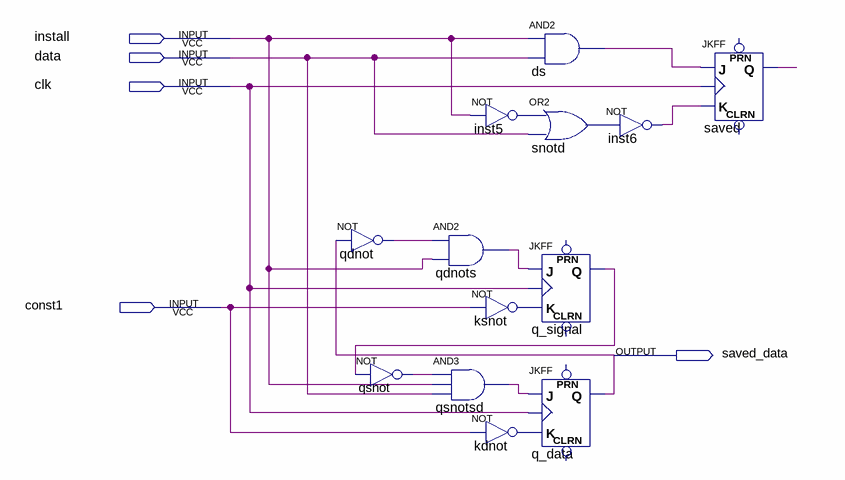
[diagram p0: schematic sheet]
// Quartus schematic onebitsaver.bdf as structural Verilog: 13 symbols, 5 pins
module onebitsaver (
  input  install,
  input  data,
  input  clk,
  input  const1,
  output saved_data
);

  wire ds_out, inst5_out, inst6_out, kdnot_out, ksnot_out, q_signal_q, qdnot_out, qdnots_out, qsnot_out,
       qsnotsd_out, saved_q, snotd_out;

  not qdnot (qdnot_out, saved_data);
  not qsnot (qsnot_out, q_signal_q);
  and qdnots (qdnots_out, qdnot_out, install);
  and qsnotsd (qsnotsd_out, qsnot_out, install, data);
  and ds (ds_out, install, data);
  not inst5 (inst5_out, install);
  or snotd (snotd_out, inst5_out, data);
  JKFF q_signal (.K(ksnot_out), .J(qdnots_out), .CLK(clk), .Q(q_signal_q));  // open: PRN, CLRN
  not ksnot (ksnot_out, const1);
  JKFF q_data (.K(kdnot_out), .J(qsnotsd_out), .CLK(clk), .Q(saved_data));  // open: PRN, CLRN
  not kdnot (kdnot_out, const1);
  not inst6 (inst6_out, snotd_out);
  JKFF saved (.K(inst6_out), .J(ds_out), .CLK(clk), .Q(saved_q));  // open: PRN, CLRN
endmodule
